# EAGLE schematic Led_Beleuchtung (EAGLE 7.3.0)

## Sheet 1 of 3
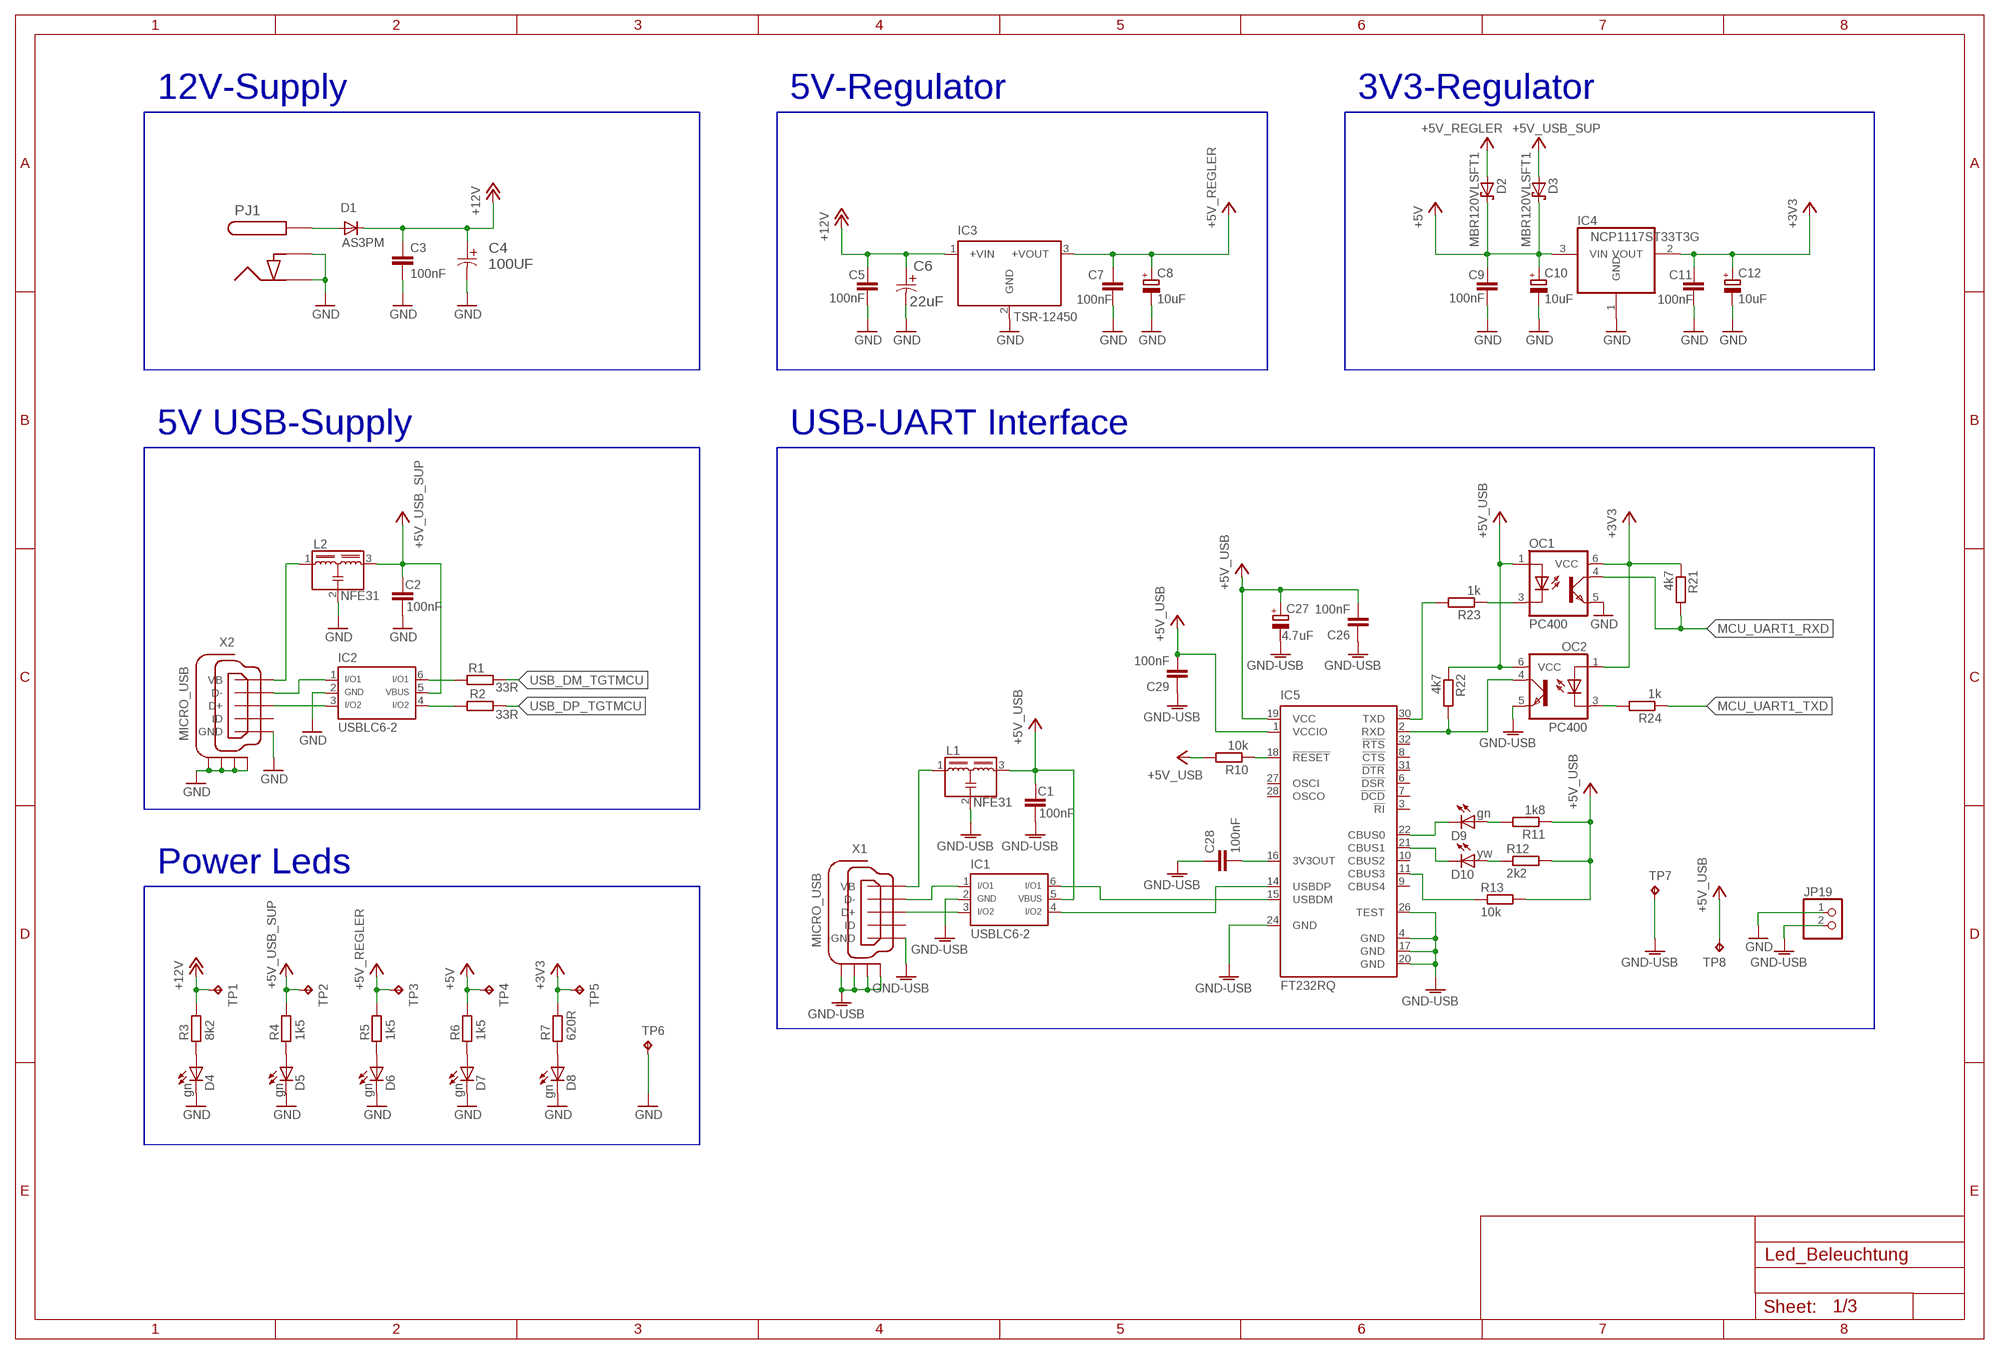
[diagram p0: schematic, sheet 1]

### Parts
C1  100nF  C-EUC0603K  [C0603K]
C2  100nF  C-EUC0603K  [C0603K]
C3  100nF  C-EUC0603K  [C0603K]
C4  100UF  EEE-FTH101XAP-CASE-D8  [CAPAE660X800N]
C5  100nF  C-EUC0603K  [C0603K]
C6  22uF  EEE--CASE-D  [CAPAE660X610N]
C7  100nF  C-EUC0603K  [C0603K]
C8  10uF  CPOL_EU0805  [SMC_P]
C9  100nF  C-EUC0603K  [C0603K]
C10  10uF  CPOL_EU0805  [SMC_P]
C11  100nF  C-EUC0603K  [C0603K]
C12  10uF  CPOL_EU0805  [SMC_P]
C26  100nF  C-EUC0603K  [C0603K]
C27  4.7uF  CPOL_EU0805  [SMC_P]
C28  100nF  C-EUC0603K  [C0603K]
C29  100nF  C-EUC0603  [C0603]
D1  AS3PM  [TO-277A]
D2  MBR120VLSFT1  [SOD-123]
D3  MBR120VLSFT1  [SOD-123]
D4  gn  LEDCHIP-LED0603  [CHIP-LED0603]
D5  gn  LEDCHIP-LED0603  [CHIP-LED0603]
D6  gn  LEDCHIP-LED0603  [CHIP-LED0603]
D7  gn  LEDCHIP-LED0603  [CHIP-LED0603]
D8  gn  LEDCHIP-LED0603  [CHIP-LED0603]
D9  gn  LEDCHIP-LED0603  [CHIP-LED0603]
D10  yw  LEDCHIP-LED0603  [CHIP-LED0603]
IC1  USBLC6-2  [SOT-23-6L]
IC2  USBLC6-2  [SOT-23-6L]
IC3  TSR-12450  [TSR-1]
IC4  NCP1117ST33T3G  REG1117  [SOT223]
IC5  FT232RQ  [QFN32]
JP19  PINHD-1X2  [1X02]
L1  NFE31  EMIFIL  [EMIFILTER]
L2  NFE31  EMIFIL  [EMIFILTER]
OC1  PC400  [PC400]
OC2  PC400  [PC400]
PJ1  PJ-002AH-SMT-TR  [PJ-002AH-SMT-TR]
R1  33R  R-EU_R0603  [R0603]
R2  33R  R-EU_R0603  [R0603]
R3  8k2  R-EU_R0603  [R0603]
R4  1k5  R-EU_R0603  [R0603]
R5  1k5  R-EU_R0603  [R0603]
R6  1k5  R-EU_R0603  [R0603]
R7  620R  R-EU_R0603  [R0603]
R10  10k  R-EU_R0603  [R0603]
R11  1k8  R-EU_R0603  [R0603]
R12  2k2  R-EU_R0603  [R0603]
R13  10k  R-EU_R0603  [R0603]
R21  4k7  R-EU_R0603  [R0603]
R22  4k7  R-EU_R0603  [R0603]
R23  1k  R-EU_R0603  [R0603]
R24  1k  R-EU_R0603  [R0603]
TP1  +12V  TPTP08R  [TP08R]
TP2  +5V_USB  TPTP08R  [TP08R]
TP3  +5V_Reg  TPTP08R  [TP08R]
TP4  +5V  TPTP08R  [TP08R]
TP5  +3V3  TPTP08R  [TP08R]
TP6  GND  TPTP08R  [TP08R]
TP7  GND  TPTP08R  [TP08R]
TP8  +5V  TPTP08R  [TP08R]
X1  MICRO_USB  [MICRO-USB]
X2  MICRO_USB  [MICRO-USB]

### Nets
3V3OUT_FT232: C28.2 IC5.16(3V3OUT)
+3V3: C11.2 C12.+ IC4.2(VOUT) OC1.6(VCC) OC2.1(A) R7.2 R21.1 TP5.TP ; also sheet 2
+5V: C9.2 C10.+ D2.C D3.C IC4.3(VIN) R6.2 TP4.TP ; also sheet 2
+5V_REGLER: C7.2 C8.+ D2.A IC3.3(+VOUT) R5.2 TP3.TP
+5V_USB: C1.2 C26.2 C27.+ C29.2 IC1.5 IC5.1(VCCIO) IC5.19(VCC) L1.3 OC1.1(A) OC2.6(VCC) R10.2 R11.1 R12.2 R13.2 R22.1 TP8.TP
+5V_USB_SUP: C2.2 D3.A IC2.5 L2.3 R4.2 TP2.TP
+12V: C3.2 C4.1 C5.2 C6.1 D1.C IC3.1(+VIN) R3.2 TP1.TP ; also sheet 3
GND: C2.1 C3.1 C4.2 C5.1 C6.2 C7.1 C8.- C9.1 C10.- C11.1 C12.- D4.C D5.C D6.C D7.C D8.C IC2.2 IC3.2(GND) IC4.1(GND) JP19.1 L2.2 OC1.5(EMI) PJ1.2 PJ1.3 TP6.TP X2.5(GND) X2.GND1(S1) X2.GND2(S2) X2.GND3(S3) X2.GND4(S4) ; also sheet 2,3
GND-USB: C1.1 C26.1 C27.- C28.1 C29.1 IC1.2 IC5.4(GND) IC5.17(GND) IC5.20(GND) IC5.24(GND) IC5.26(TEST) JP19.2 L1.2 OC2.5(EMI) TP7.TP X1.5(GND) X1.GND1(S1) X1.GND2(S2) X1.GND3(S3) X1.GND4(S4)
MCU_UART1_RXD: OC1.4(COL) R21.2 ; also sheet 2
MCU_UART1_TXD: R24.1 ; also sheet 2
N$3: IC5.18(!RESET) R10.1
N$9: D9.C IC5.22(CBUS0)
N$13: L1.1 X1.1(VB)
N$14: IC1.1 X1.2(D-)
N$15: IC1.3 X1.3(D+)
N$16: D4.A R3.1
N$17: L2.1 X2.1(VB)
N$18: D5.A R4.1
N$19: D10.C IC5.21(CBUS1)
N$21: D10.A R12.1
N$22: D9.A R11.2
N$23: IC5.11(CBUS3) R13.1
N$26: IC2.1 X2.2(D-)
N$27: IC2.3 X2.3(D+)
N$48: IC2.4 R2.1
N$49: IC2.6 R1.1
N$61: D6.A R5.1
N$86: D1.A1(A) D1.A2(A) PJ1.1.1 PJ1.1.2
N$88: D7.A R6.1
N$90: D8.A R7.1
N$91: OC1.3(C) R23.1
N$93: OC2.3(C) R24.2
N$95: IC5.30(TXD) R23.2
N$97: IC5.2(RXD) OC2.4(COL) R22.2
USB_DM_FT232: IC1.6 IC5.15(USBDM)
USB_DM_TGTMCU: R1.2 ; also sheet 2
USB_DP_FT232: IC1.4 IC5.14(USBDP)
USB_DP_TGTMCU: R2.2 ; also sheet 2
Unconnected: IC5.3(!RI) IC5.6(!DSR) IC5.7(!DCD) IC5.8(!CTS) IC5.9(CBUS4) IC5.10(CBUS2) IC5.27(OSCI) IC5.28(OSCO) IC5.31(!DTR) IC5.32(!RTS) X1.4(ID) X2.4(ID)

### Notes on the sheet
- 12V-Supply | 5V-Regulator | 3V3-Regulator
- 5V USB-Supply | USB-UART Interface
- Power Leds
- http://www.molex.com/pdm_docs/sd/5031821853_sd.pdf 
  http://pinouts.ru/Memory/sdcard_pinout.shtml 
  http://www.interfacebus.com/Secure_Digital_Card_Pinout.html 
  https://en.wikipedia.org/wiki/Secure_Digital

## Sheet 2 of 3
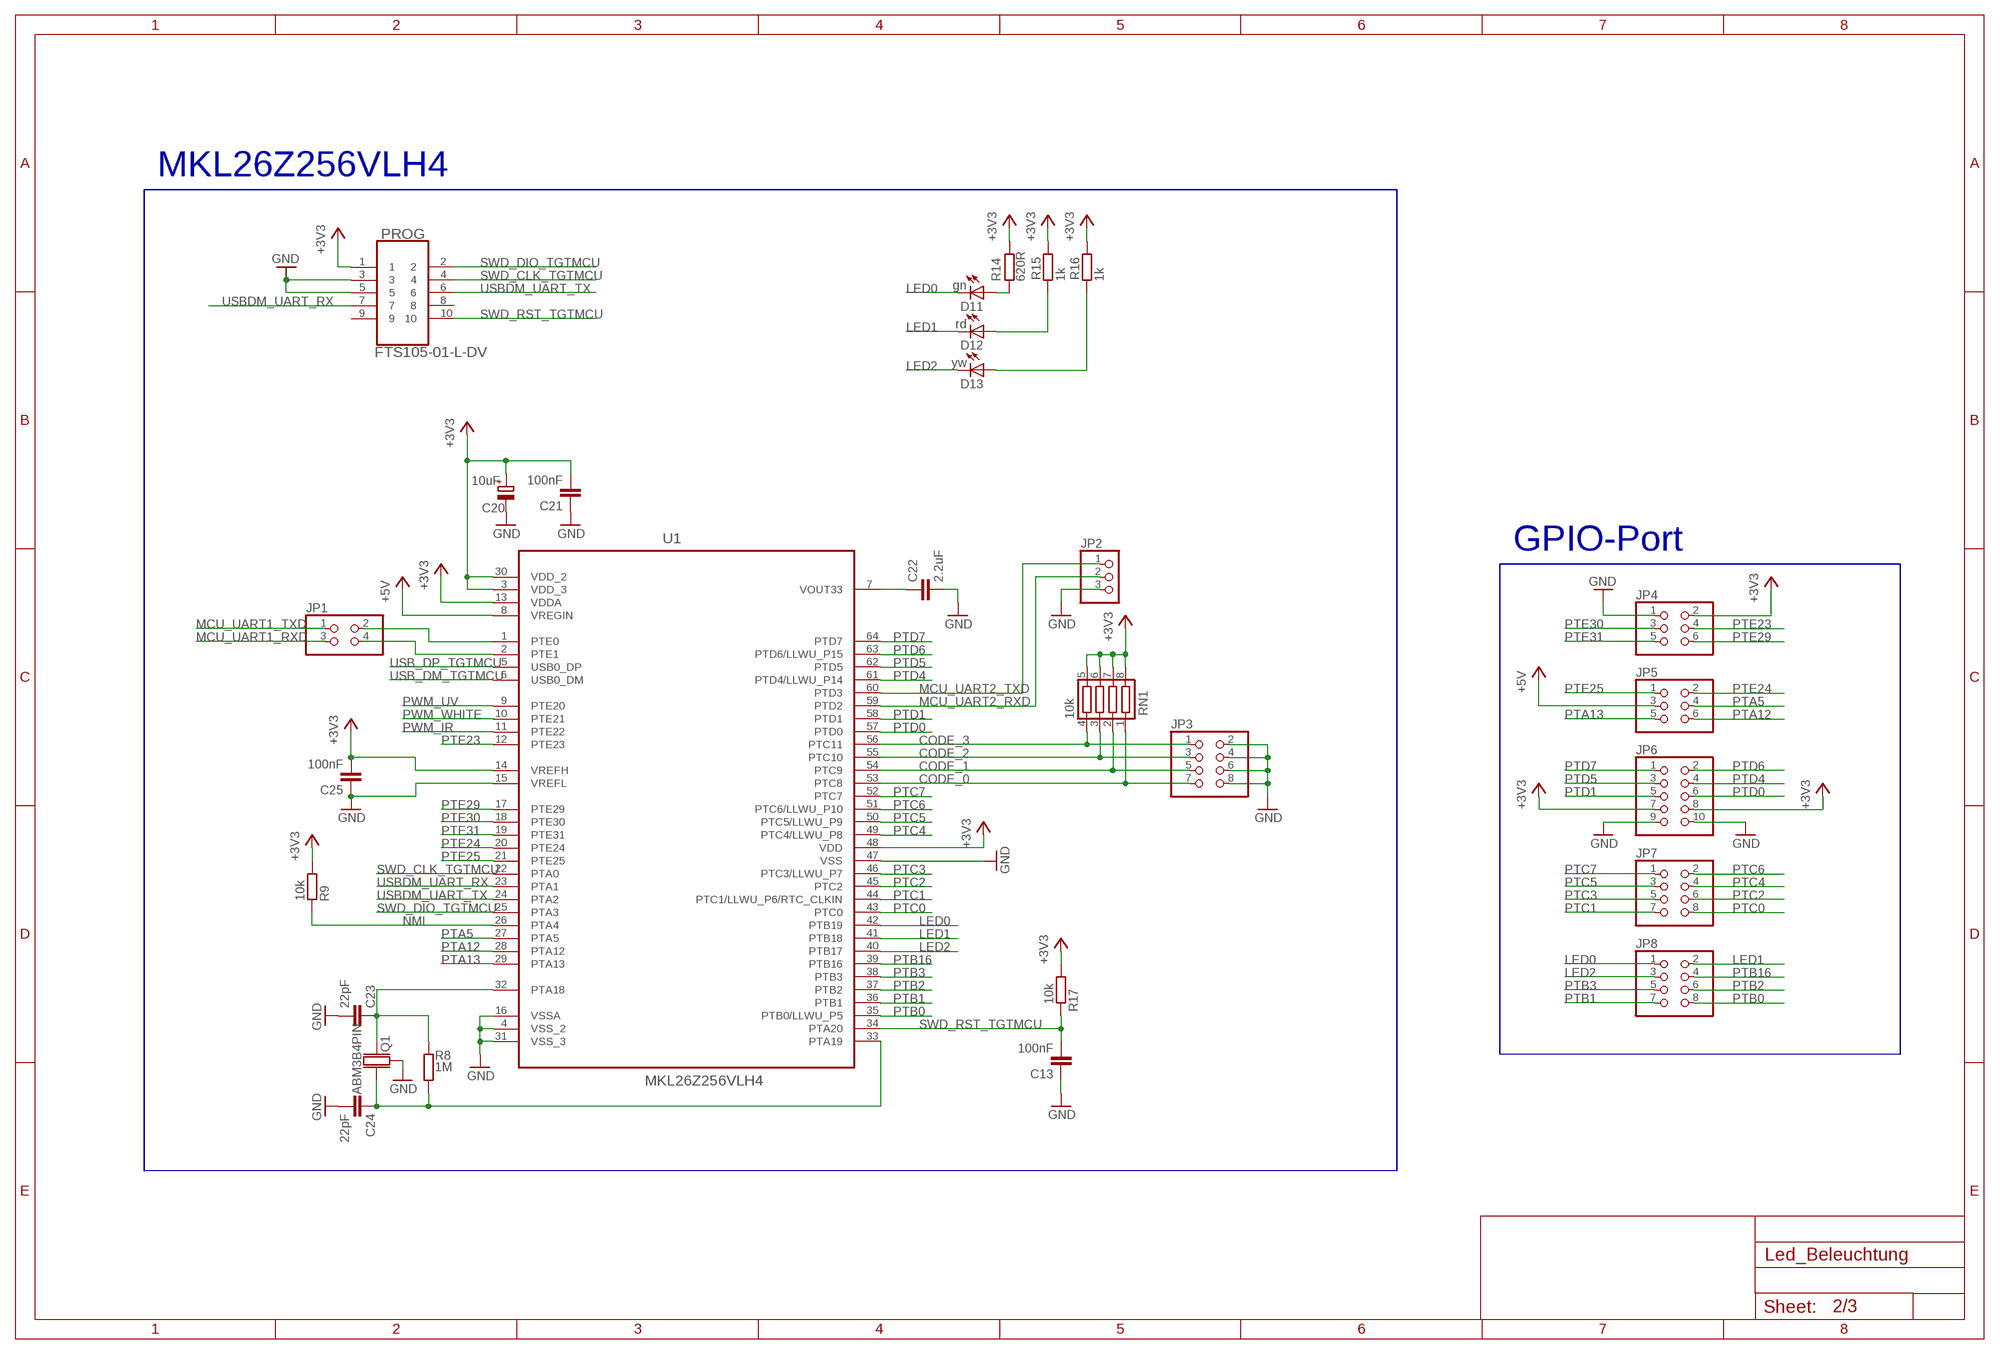
[diagram p1: schematic, sheet 2]

### Parts
C13  100nF  C-EUC0603  [C0603]
C20  10uF  CPOL_EU0805  [SMC_P]
C21  100nF  C-EUC0603  [C0603]
C22  2.2uF  C-EUC0603  [C0603]
C23  22pF  C-EUC0603  [C0603]
C24  22pF  C-EUC0603  [C0603]
C25  100nF  C-EUC0603K  [C0603K]
D11  gn  LEDCHIP-LED0603  [CHIP-LED0603]
D12  rd  LEDCHIP-LED0603  [CHIP-LED0603]
D13  yw  LEDCHIP-LED0603  [CHIP-LED0603]
JP1  PINHD-2X2  [2X02]
JP2  BCH-381H-3GN  [BCH-381H-3GN]
JP3  PINHD-2X4  [2X04]
JP4  PINHD-2X3  [2X03]
JP5  PINHD-2X3  [2X03]
JP6  PINHD-2X5  [2X05]
JP7  PINHD-2X4  [2X04]
JP8  PINHD-2X4  [2X04]
PROG  FTS105-01-L-DV  [SAMTEC_FTS105-01-L-DV]
Q1  ABM3B4PIN  [ABM3B]
R8  1M  R-EU_R0603  [R0603]
R9  10k  R-EU_R0603  [R0603]
R14  620R  R-EU_R0603  [R0603]
R15  1k  R-EU_R0603  [R0603]
R16  1k  R-EU_R0603  [R0603]
R17  10k  R-EU_R0603  [R0603]
RN1  10k  CTS742C083  [CTS742C083]
U1  MKL26Z256VLH4  [QFP50P1200X1200X160-64N]

### Nets
+3V3: C20.+ C21.2 C25.2 JP4.2 JP6.7 JP6.8 PROG.1 R9.1 R14.2 R15.2 R16.2 R17.1 RN1.5 RN1.6 RN1.7 RN1.8 U1.3(VDD_3) U1.13(VDDA) U1.14(VREFH) U1.30(VDD_2) U1.48(VDD) ; also sheet 1
+5V: JP5.3 U1.8(VREGIN) ; also sheet 1
CODE_0: JP3.7 RN1.1 U1.53(PTC8)
CODE_1: JP3.5 RN1.2 U1.54(PTC9)
CODE_2: JP3.3 RN1.3 U1.55(PTC10)
CODE_3: JP3.1 RN1.4 U1.56(PTC11)
GND: C13.1 C20.- C21.1 C22.2 C23.2 C24.2 C25.1 JP2.3 JP3.2 JP3.4 JP3.6 JP3.8 JP4.1 JP6.9 JP6.10 PROG.3 PROG.5 Q1.GND1(GND) Q1.GND2(GND) U1.4(VSS_2) U1.15(VREFL) U1.16(VSSA) U1.31(VSS_3) U1.47(VSS) ; also sheet 1,3
LED0: D11.C JP8.1 U1.42(PTB19)
LED1: D12.C JP8.2 U1.41(PTB18)
LED2: D13.C JP8.3 U1.40(PTB17)
MCU_UART1_RXD: JP1.3 ; also sheet 1
MCU_UART1_TXD: JP1.1 ; also sheet 1
MCU_UART2_RXD: JP2.2 U1.59(PTD2)
MCU_UART2_TXD: JP2.1 U1.60(PTD3)
N$10: C23.1 Q1.1 R8.2 U1.32(PTA18)
N$11: C24.1 Q1.3 R8.1 U1.33(PTA19)
N$12: D11.A R14.1
N$36: D12.A R15.1
N$37: D13.A R16.1
N$47: C22.1 U1.7(VOUT33)
N$92: JP1.2 U1.1(PTE0)
N$94: JP1.4 U1.2(PTE1)
NMI: R9.2 U1.26(PTA4)
PTA5: JP5.4 U1.27(PTA5)
PTA12: JP5.6 U1.28(PTA12)
PTA13: JP5.5 U1.29(PTA13)
PTB0: JP8.8 U1.35(PTB0/LLWU_P5)
PTB1: JP8.7 U1.36(PTB1)
PTB2: JP8.6 U1.37(PTB2)
PTB3: JP8.5 U1.38(PTB3)
PTB16: JP8.4 U1.39(PTB16)
PTC0: JP7.8 U1.43(PTC0)
PTC1: JP7.7 U1.44(PTC1/LLWU_P6/RTC_CLKIN)
PTC2: JP7.6 U1.45(PTC2)
PTC3: JP7.5 U1.46(PTC3/LLWU_P7)
PTC4: JP7.4 U1.49(PTC4/LLWU_P8)
PTC5: JP7.3 U1.50(PTC5/LLWU_P9)
PTC6: JP7.2 U1.51(PTC6/LLWU_P10)
PTC7: JP7.1 U1.52(PTC7)
PTD0: JP6.6 U1.57(PTD0)
PTD1: JP6.5 U1.58(PTD1)
PTD4: JP6.4 U1.61(PTD4/LLWU_P14)
PTD5: JP6.3 U1.62(PTD5)
PTD6: JP6.2 U1.63(PTD6/LLWU_P15)
PTD7: JP6.1 U1.64(PTD7)
PTE23: JP4.4 U1.12(PTE23)
PTE24: JP5.2 U1.20(PTE24)
PTE25: JP5.1 U1.21(PTE25)
PTE29: JP4.6 U1.17(PTE29)
PTE30: JP4.3 U1.18(PTE30)
PTE31: JP4.5 U1.19(PTE31)
PWM_IR: U1.11(PTE22) ; also sheet 3
PWM_UV: U1.9(PTE20) ; also sheet 3
PWM_WHITE: U1.10(PTE21) ; also sheet 3
SWD_CLK_TGTMCU: PROG.4 U1.22(PTA0)
SWD_DIO_TGTMCU: PROG.2 U1.25(PTA3)
SWD_RST_TGTMCU: C13.2 PROG.10 R17.2 U1.34(PTA20)
USB_DM_TGTMCU: U1.6(USB0_DM) ; also sheet 1
USB_DP_TGTMCU: U1.5(USB0_DP) ; also sheet 1
USBDM_UART_RX: PROG.7 U1.23(PTA1)
USBDM_UART_TX: PROG.6 U1.24(PTA2)
Unconnected: PROG.8 PROG.9

### Notes on the sheet
- MKL26Z256VLH4
- GPIO-Port

## Sheet 3 of 3
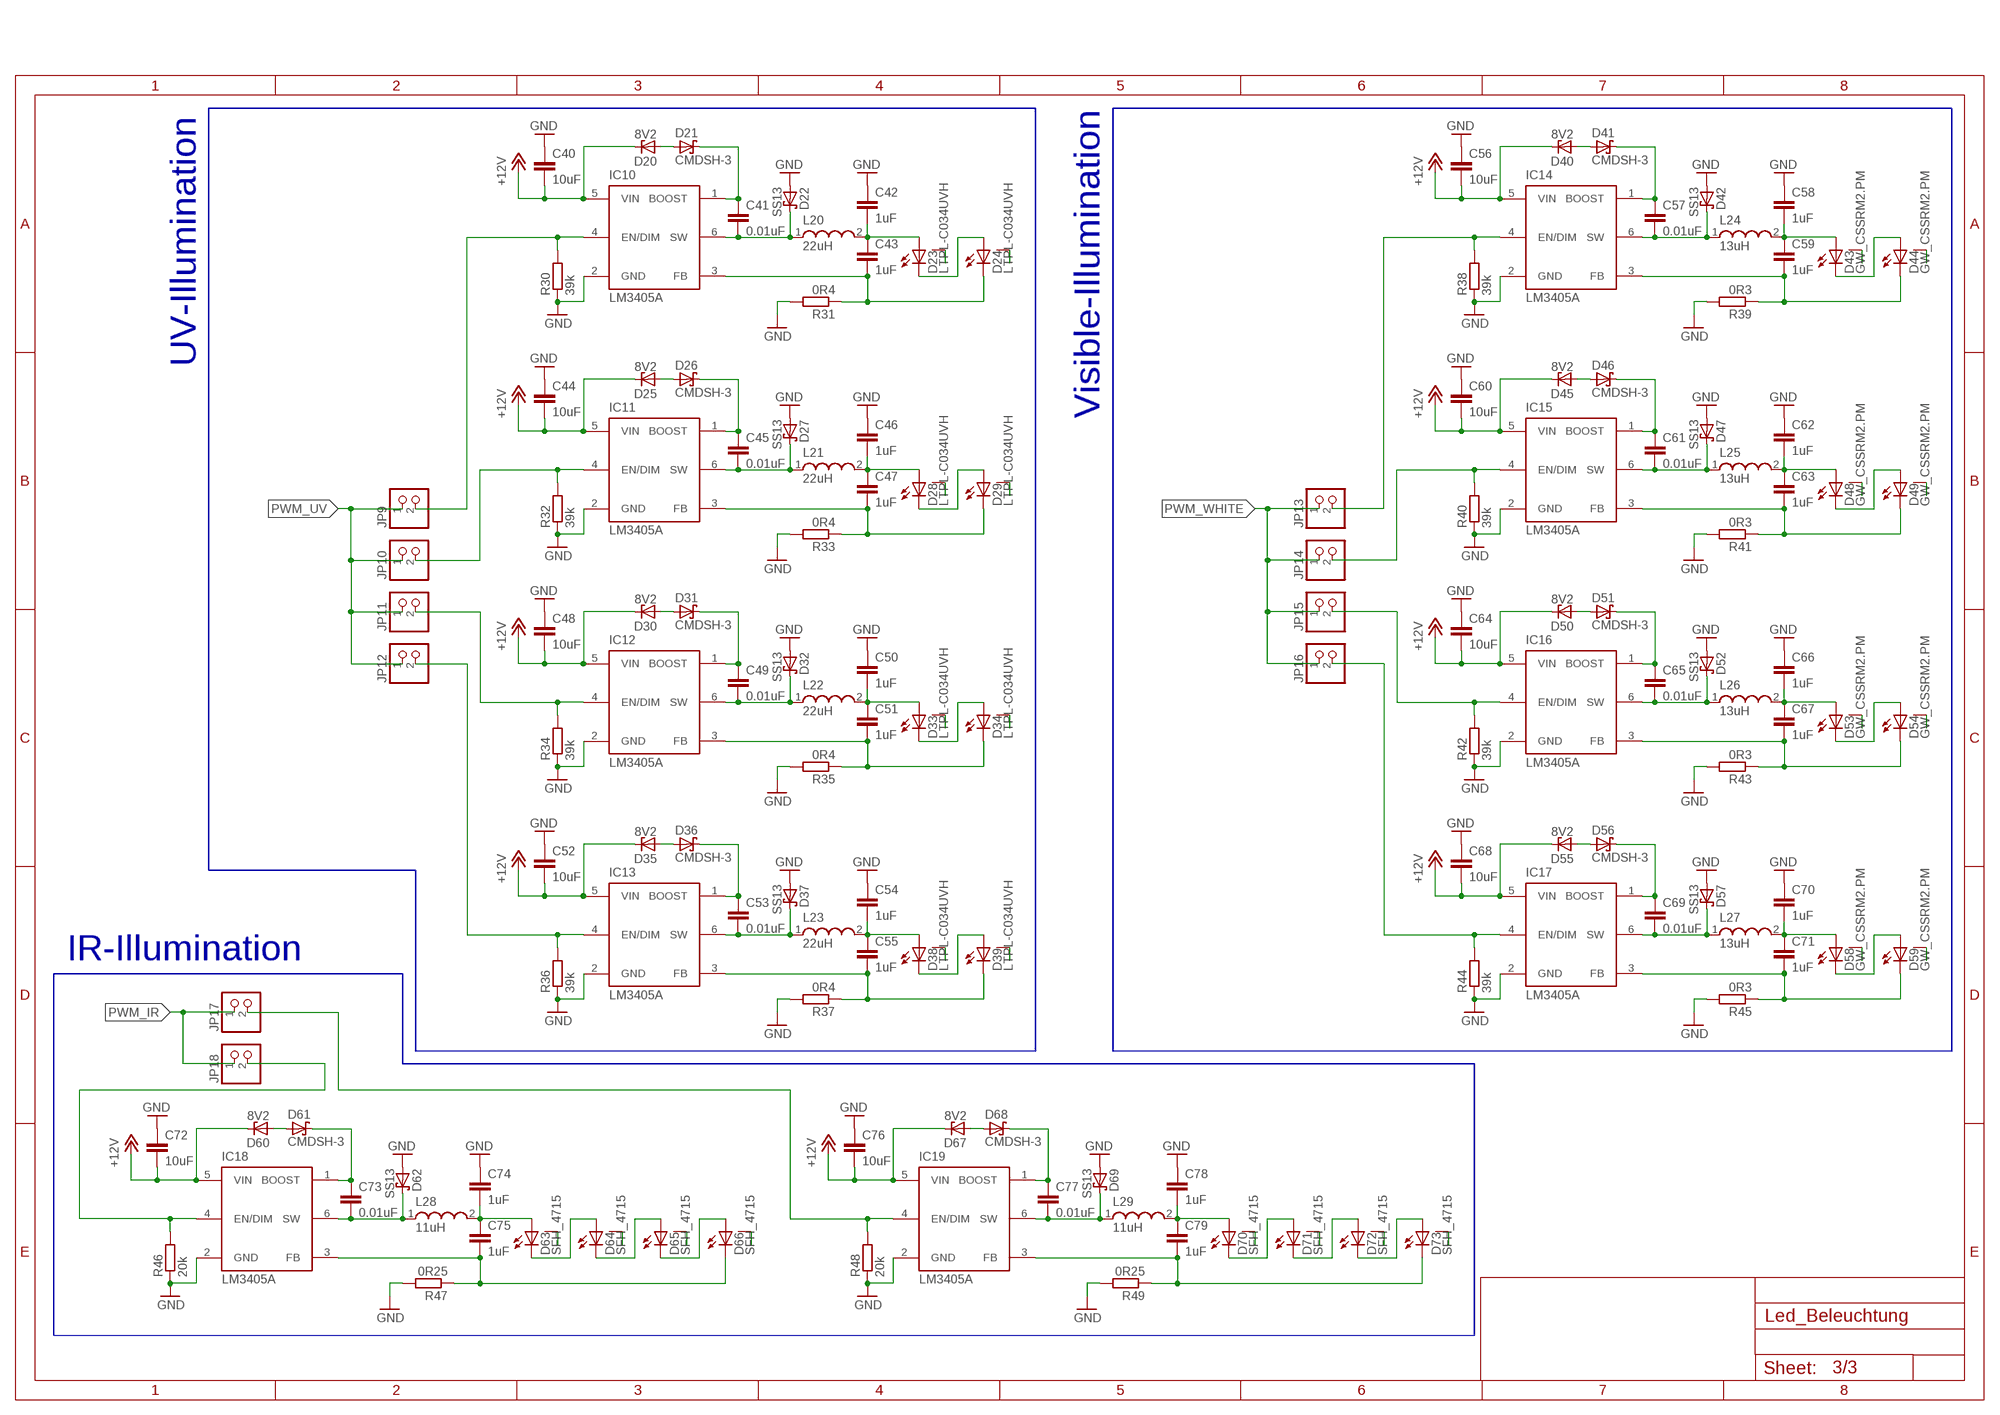
[diagram p2: schematic, sheet 3]

### Parts
C40  10uF  C-EUC1206K  [C1206K]
C41  0.01uF  C-EUC0805K  [C0805K]
C42  1uF  C-EUC1206K  [C1206K]
C43  1uF  C-EUC1206K  [C1206K]
C44  10uF  C-EUC1206K  [C1206K]
C45  0.01uF  C-EUC0805K  [C0805K]
C46  1uF  C-EUC1206K  [C1206K]
C47  1uF  C-EUC1206K  [C1206K]
C48  10uF  C-EUC1206K  [C1206K]
C49  0.01uF  C-EUC0805K  [C0805K]
C50  1uF  C-EUC1206K  [C1206K]
C51  1uF  C-EUC1206K  [C1206K]
C52  10uF  C-EUC1206K  [C1206K]
C53  0.01uF  C-EUC0805K  [C0805K]
C54  1uF  C-EUC1206K  [C1206K]
C55  1uF  C-EUC1206K  [C1206K]
C56  10uF  C-EUC1206K  [C1206K]
C57  0.01uF  C-EUC0805K  [C0805K]
C58  1uF  C-EUC1206K  [C1206K]
C59  1uF  C-EUC1206K  [C1206K]
C60  10uF  C-EUC1206K  [C1206K]
C61  0.01uF  C-EUC0805K  [C0805K]
C62  1uF  C-EUC1206K  [C1206K]
C63  1uF  C-EUC1206K  [C1206K]
C64  10uF  C-EUC1206K  [C1206K]
C65  0.01uF  C-EUC0805K  [C0805K]
C66  1uF  C-EUC1206K  [C1206K]
C67  1uF  C-EUC1206K  [C1206K]
C68  10uF  C-EUC1206K  [C1206K]
C69  0.01uF  C-EUC0805K  [C0805K]
C70  1uF  C-EUC1206K  [C1206K]
C71  1uF  C-EUC1206K  [C1206K]
C72  10uF  C-EUC1206K  [C1206K]
C73  0.01uF  C-EUC0805K  [C0805K]
C74  1uF  C-EUC1206K  [C1206K]
C75  1uF  C-EUC1206K  [C1206K]
C76  10uF  C-EUC1206K  [C1206K]
C77  0.01uF  C-EUC0805K  [C0805K]
C78  1uF  C-EUC1206K  [C1206K]
C79  1uF  C-EUC1206K  [C1206K]
D20  8V2  ZENER-DIODESOT23  [SOT23]
D21  CMDSH-3  [SOD323]
D22  SS13  [DO-214AC]
D23  LTPL-C034UVH  [LTPL-C034UVH]
D24  LTPL-C034UVH  [LTPL-C034UVH]
D25  8V2  ZENER-DIODESOT23  [SOT23]
D26  CMDSH-3  [SOD323]
D27  SS13  [DO-214AC]
D28  LTPL-C034UVH  [LTPL-C034UVH]
D29  LTPL-C034UVH  [LTPL-C034UVH]
D30  8V2  ZENER-DIODESOT23  [SOT23]
D31  CMDSH-3  [SOD323]
D32  SS13  [DO-214AC]
D33  LTPL-C034UVH  [LTPL-C034UVH]
D34  LTPL-C034UVH  [LTPL-C034UVH]
D35  8V2  ZENER-DIODESOT23  [SOT23]
D36  CMDSH-3  [SOD323]
D37  SS13  [DO-214AC]
D38  LTPL-C034UVH  [LTPL-C034UVH]
D39  LTPL-C034UVH  [LTPL-C034UVH]
D40  8V2  ZENER-DIODESOT23  [SOT23]
D41  CMDSH-3  [SOD323]
D42  SS13  [DO-214AC]
D43  GW_CSSRM2.PM  [GW_CSSRM2.PM]
D44  GW_CSSRM2.PM  [GW_CSSRM2.PM]
D45  8V2  ZENER-DIODESOT23  [SOT23]
D46  CMDSH-3  [SOD323]
D47  SS13  [DO-214AC]
D48  GW_CSSRM2.PM  [GW_CSSRM2.PM]
D49  GW_CSSRM2.PM  [GW_CSSRM2.PM]
D50  8V2  ZENER-DIODESOT23  [SOT23]
D51  CMDSH-3  [SOD323]
D52  SS13  [DO-214AC]
D53  GW_CSSRM2.PM  [GW_CSSRM2.PM]
D54  GW_CSSRM2.PM  [GW_CSSRM2.PM]
D55  8V2  ZENER-DIODESOT23  [SOT23]
D56  CMDSH-3  [SOD323]
D57  SS13  [DO-214AC]
D58  GW_CSSRM2.PM  [GW_CSSRM2.PM]
D59  GW_CSSRM2.PM  [GW_CSSRM2.PM]
D60  8V2  ZENER-DIODESOT23  [SOT23]
D61  CMDSH-3  [SOD323]
D62  SS13  [DO-214AC]
D63  SFH_4715  [SFH_4715]
D64  SFH_4715  [SFH_4715]
D65  SFH_4715  [SFH_4715]
D66  SFH_4715  [SFH_4715]
D67  8V2  ZENER-DIODESOT23  [SOT23]
D68  CMDSH-3  [SOD323]
D69  SS13  [DO-214AC]
D70  SFH_4715  [SFH_4715]
D71  SFH_4715  [SFH_4715]
D72  SFH_4715  [SFH_4715]
D73  SFH_4715  [SFH_4715]
IC10  LM3405A  [DDC6_SOT]
IC11  LM3405A  [DDC6_SOT]
IC12  LM3405A  [DDC6_SOT]
IC13  LM3405A  [DDC6_SOT]
IC14  LM3405A  [DDC6_SOT]
IC15  LM3405A  [DDC6_SOT]
IC16  LM3405A  [DDC6_SOT]
IC17  LM3405A  [DDC6_SOT]
IC18  LM3405A  [DDC6_SOT]
IC19  LM3405A  [DDC6_SOT]
JP9  PINHD-1X2  [1X02]
JP10  PINHD-1X2  [1X02]
JP11  PINHD-1X2  [1X02]
JP12  PINHD-1X2  [1X02]
JP13  PINHD-1X2  [1X02]
JP14  PINHD-1X2  [1X02]
JP15  PINHD-1X2  [1X02]
JP16  PINHD-1X2  [1X02]
JP17  PINHD-1X2  [1X02]
JP18  PINHD-1X2  [1X02]
L20  22uH  WE-PDF_1064  [WE-PDF]
L21  22uH  WE-PDF_1064  [WE-PDF]
L22  22uH  WE-PDF_1064  [WE-PDF]
L23  22uH  WE-PDF_1064  [WE-PDF]
L24  13uH  WE-PDF_1064  [WE-PDF]
L25  13uH  WE-PDF_1064  [WE-PDF]
L26  13uH  WE-PDF_1064  [WE-PDF]
L27  13uH  WE-PDF_1064  [WE-PDF]
L28  11uH  WE-PDF_1064  [WE-PDF]
L29  11uH  WE-PDF_1064  [WE-PDF]
R30  39k  R-EU_R0603  [R0603]
R31  0R4  R-EU_R2010  [R2010]
R32  39k  R-EU_R0603  [R0603]
R33  0R4  R-EU_R2010  [R2010]
R34  39k  R-EU_R0603  [R0603]
R35  0R4  R-EU_R2010  [R2010]
R36  39k  R-EU_R0603  [R0603]
R37  0R4  R-EU_R2010  [R2010]
R38  39k  R-EU_R0603  [R0603]
R39  0R3  R-EU_R2010  [R2010]
R40  39k  R-EU_R0603  [R0603]
R41  0R3  R-EU_R2010  [R2010]
R42  39k  R-EU_R0603  [R0603]
R43  0R3  R-EU_R2010  [R2010]
R44  39k  R-EU_R0603  [R0603]
R45  0R3  R-EU_R2010  [R2010]
R46  20k  R-EU_R0603  [R0603]
R47  0R25  R-EU_R2010  [R2010]
R48  20k  R-EU_R0603  [R0603]
R49  0R25  R-EU_R2010  [R2010]

### Nets
+12V: C40.2 C44.2 C48.2 C52.2 C56.2 C60.2 C64.2 C68.2 C72.2 C76.2 D20.3(C) D25.3(C) D30.3(C) D35.3(C) D40.3(C) D45.3(C) D50.3(C) D55.3(C) D60.3(C) D67.3(C) IC10.5(VIN) IC11.5(VIN) IC12.5(VIN) IC13.5(VIN) IC14.5(VIN) IC15.5(VIN) IC16.5(VIN) IC17.5(VIN) IC18.5(VIN) IC19.5(VIN) ; also sheet 1
GND: C40.1 C42.1 C44.1 C46.1 C48.1 C50.1 C52.1 C54.1 C56.1 C58.1 C60.1 C62.1 C64.1 C66.1 C68.1 C70.1 C72.1 C74.1 C76.1 C78.1 D22.A D27.A D32.A D37.A D42.A D47.A D52.A D57.A D62.A D69.A IC10.2(GND) IC11.2(GND) IC12.2(GND) IC13.2(GND) IC14.2(GND) IC15.2(GND) IC16.2(GND) IC17.2(GND) IC18.2(GND) IC19.2(GND) R30.1 R31.2 R32.1 R33.2 R34.1 R35.2 R36.1 R37.2 R38.1 R39.2 R40.1 R41.2 R42.1 R43.2 R44.1 R45.2 R46.1 R47.2 R48.1 R49.2 ; also sheet 1,2
LED_WHITE8: D58.C D59.A
N$1: C77.1 D68.C IC19.1(BOOST)
N$2: D67.1(A) D68.A
N$4: C77.2 D69.C IC19.6(SW) L29.1
N$5: C78.2 C79.1 D70.A L29.2
N$6: D70.C D71.A
N$7: D71.C D72.A
N$8: D72.C D73.A
N$20: C79.2 D73.C IC19.3(FB) R49.1
N$24: C57.1 D41.C IC14.1(BOOST)
N$25: C73.1 D61.C IC18.1(BOOST)
N$28: D60.1(A) D61.A
N$29: C73.2 D62.C IC18.6(SW) L28.1
N$30: C74.2 C75.1 D63.A L28.2
N$31: D63.C D64.A
N$32: D64.C D65.A
N$33: D65.C D66.A
N$34: C75.2 D66.C IC18.3(FB) R47.1
N$35: D40.1(A) D41.A
N$38: C57.2 D42.C IC14.6(SW) L24.1
N$39: C58.2 C59.1 D43.A L24.2
N$40: D43.C D44.A
N$41: C61.1 D46.C IC15.1(BOOST)
N$42: D45.1(A) D46.A
N$43: C59.2 D44.C IC14.3(FB) R39.1
N$44: C61.2 D47.C IC15.6(SW) L25.1
N$45: C62.2 C63.1 D48.A L25.2
N$46: D48.C D49.A
N$50: C63.2 D49.C IC15.3(FB) R41.1
N$51: C65.1 D51.C IC16.1(BOOST)
N$52: D50.1(A) D51.A
N$53: C65.2 D52.C IC16.6(SW) L26.1
N$54: C66.2 C67.1 D53.A L26.2
N$55: D53.C D54.A
N$56: C67.2 D54.C IC16.3(FB) R43.1
N$57: C69.1 D56.C IC17.1(BOOST)
N$58: D55.1(A) D56.A
N$59: C69.2 D57.C IC17.6(SW) L27.1
N$60: C70.2 C71.1 D58.A L27.2
N$62: C71.2 D59.C IC17.3(FB) R45.1
N$63: C41.1 D21.C IC10.1(BOOST)
N$64: D20.1(A) D21.A
N$65: C41.2 D22.C IC10.6(SW) L20.1
N$66: C42.2 C43.1 D23.A L20.2
N$67: D23.C D24.A
N$68: C43.2 D24.C IC10.3(FB) R31.1
N$69: C45.1 D26.C IC11.1(BOOST)
N$70: D25.1(A) D26.A
N$71: C45.2 D27.C IC11.6(SW) L21.1
N$72: C46.2 C47.1 D28.A L21.2
N$73: D28.C D29.A
N$74: C47.2 D29.C IC11.3(FB) R33.1
N$75: C49.1 D31.C IC12.1(BOOST)
N$76: D30.1(A) D31.A
N$77: C49.2 D32.C IC12.6(SW) L22.1
N$78: C50.2 C51.1 D33.A L22.2
N$79: D33.C D34.A
N$80: C51.2 D34.C IC12.3(FB) R35.1
N$81: C53.1 D36.C IC13.1(BOOST)
N$82: D35.1(A) D36.A
N$83: C53.2 D37.C IC13.6(SW) L23.1
N$84: C54.2 C55.1 D38.A L23.2
N$85: D38.C D39.A
N$87: C55.2 D39.C IC13.3(FB) R37.1
N$98: IC10.4(EN/DIM) JP9.2 R30.2
N$99: IC11.4(EN/DIM) JP10.2 R32.2
N$100: IC12.4(EN/DIM) JP11.2 R34.2
N$101: IC13.4(EN/DIM) JP12.2 R36.2
N$102: IC14.4(EN/DIM) JP13.2 R38.2
N$103: IC15.4(EN/DIM) JP14.2 R40.2
N$104: IC16.4(EN/DIM) JP15.2 R42.2
N$105: IC17.4(EN/DIM) JP16.2 R44.2
N$106: IC18.4(EN/DIM) JP18.2 R46.2
N$107: IC19.4(EN/DIM) JP17.2 R48.2
PWM_IR: JP17.1 JP18.1 ; also sheet 2
PWM_UV: JP9.1 JP10.1 JP11.1 JP12.1 ; also sheet 2
PWM_WHITE: JP13.1 JP14.1 JP15.1 JP16.1 ; also sheet 2
TH_D23: D23.TH
TH_D24: D24.TH
TH_D28: D28.TH
TH_D29: D29.TH
TH_D33: D33.TH
TH_D34: D34.TH
TH_D38: D38.TH
TH_D39: D39.TH
TH_D43: D43.TH
TH_D44: D44.TH
TH_D48: D48.TH
TH_D49: D49.TH
TH_D53: D53.TH
TH_D54: D54.TH
TH_D58: D58.TH
TH_D59: D59.TH
TH_D63: D63.TH
TH_D64: D64.TH
TH_D65: D65.TH
TH_D66: D66.TH
TH_D70: D70.TH
TH_D71: D71.TH
TH_D72: D72.TH
TH_D73: D73.TH

### Notes on the sheet
- UV-Illumination
- Visible-Illumination
- IR-Illumination

## Library data of the parts
C1-C3 C5 C7 C9 C11 C13 C21-C26 C28 C29 C40-C79 = rcl:C-EU: CAPACITOR, European symbol
C4 = Panasonic-EEEFT_EEEH:EEE-: Aluminum Electrolytic Capacitors,Surface Mount Type; MPN: EEE-FTH101XAP; OC_FARNELL: 1868426; OC_NEWARK: 31T8172; PACKAGE: CASE-D8; SUPPLIER: PANASONIC; TOLERANCE: ±20 %; VOLTAGERATING: 50V
C6 = Panasonic-EEEFT_EEEH:EEE-: Aluminum Electrolytic Capacitors,Surface Mount Type
C8 C10 C12 C20 C27 = myLib:CPOL_EU: Solid Tantalum SMD Cap, Size 0805 or P Footprint from: http://www.niccomp.com/Products/smt/NTCMRK1000.pdf Tantalum Farnell: http://www.farnell.com/datasheets/1948248.pdf Farnell Nr. : 2491435RL Solid Tantalum SMD Cap, Size 1411 or B Tantalum Farnell: http://www.farnell.com/datasheets/2245107.pdf?_ga=1.151905337.1400796248.1488872329f Farnell Nr. : TMCUB1C106KTRF
D1 = myLib:AS3PM: http://www.mouser.com/ds/2/427/as3pd-101473.pdf
D2 D3 = myLib:MBR120VLSFT1: Schottky Power Rectifier Source: http://www.mouser.com/ds/2/308/MBR120VLSFT1-D-107081.pdf
D4-D13 = led:LED: LED OSRAM: - CHIPLED LG R971, LG N971, LY N971, LG Q971, LY Q971, LO R971, LY R971 LH N974, LH R974 LS Q976, LO Q976, LY Q976 LO Q996 - Hyper CHIPLED LW Q18S LB Q993, LB Q99A, LB R99A - SideLED LS A670, LO A670, LY A670, LG A670, LP A670 LB A673, LV A673, LT A673, LW A673 LH A674 LY A675 LS A676, LA A676, LO A676, LY A676, LW A676 LS A679, LY A679, LG A679 - Hyper Micro SIDELED® LS Y876, LA Y876, LO Y876, LY Y876 LT Y87S - SmartLED LW L88C, LW L88S LB L89C, LB L89S, LG L890 LS L89K, LO L89K, LY L89K LS L896, LA L896, LO L896, LY L896 - TOPLED LS T670, LO T670, LY T670, LG T670, LP T670 LSG T670, LSP T670, LSY T670, LOP T670, LYG T670 LG T671, LOG T671, LSG T671 LB T673, LV T673, LT T673, LW T673 LH T674 LS T676, LA T676, LO T676, LY T676, LB T676, LH T676, LSB T676, LW T676 LB T67C, LV T67C, LT T67C, LS T67K, LO T67K, LY T67K, LW E67C LS E67B, LA E67B, LO E67B, LY E67B, LB E67C, LV E67C, LT E67C LW T67C LS T679, LY T679, LG T679 LS T770, LO T770, LY T770, LG T770, LP T770 LB T773, LV T773, LT T773, LW T773 LH T774 LS E675, LA E675, LY E675, LS T675 LS T776, LA T776, LO T776, LY T776, LB T776 LHGB T686 LT T68C, LB T68C - Hyper Mini TOPLED® LB M676 - Mini TOPLED Santana® LG M470 LS M47K, LO M47K, LY M47K Source: http://www.osram.convergy.de LUXEON: - LUMILED® LXK2-PW12-R00, LXK2-PW12-S00, LXK2-PW14-U00, LXK2-PW14-V00 LXK2-PM12-R00, LXK2-PM12-S00, LXK2-PM14-U00 LXK2-PE12-Q00, LXK2-PE12-R00, LXK2-PE12-S00, LXK2-PE14-T00, LXK2-PE14-U00 LXK2-PB12-K00, LXK2-PB12-L00, LXK2-PB12-M00, LXK2-PB14-N00, LXK2-PB14-P00, LXK2-PB14-Q00 LXK2-PR12-L00, LXK2-PR12-M00, LXK2-PR14-Q00, LXK2-PR14-R00 LXK2-PD12-Q00, LXK2-PD12-R00, LXK2-PD12-S00 LXK2-PH12-R00, LXK2-PH12-S00 LXK2-PL12-P00, LXK2-PL12-Q00, LXK2-PL12-R00 Source: www.luxeon.com KINGBRIGHT: KA-3528ASYC Source: www.kingbright.com
D20 D25 D30 D35 D40 D45 D50 D55 D60 D67 = diode:ZENER-DIODE: Z-Diode
D21 D26 D31 D36 D41 D46 D51 D56 D61 D68 = myLib:CMDSH-3: http://www.mouser.com/ds/2/68/cmdsh-3-39175.pdf
D22 D27 D32 D37 D42 D47 D52 D57 D62 D69 = myLib:SS13: http://www.mouser.com/ds/2/427/ss12-100300.pdf
D23 D24 D28 D29 D33 D34 D38 D39 = myLib:LTPL-C034UVH: LITEON Led High Power LTPL-C034UVH385 Source: http://www.mouser.com/ds/2/239/LTPL-C034UVH385%20DataSheet_Ver4_20150916-775666.pdf
D43 D44 D48 D49 D53 D54 D58 D59 = myLib:GW_CSSRM2.PM: OSLON ® Square: GW CSSRM2.PM Source: http://www.mouser.com/ds/2/311/GW%20CSSRM2.PM%20-%20OSLON%20Square%20Gen%203%20(EnglishDeutsch)-1073956.pdf
D63-D66 D70-D73 = myLib:SFH_4715: OSLON Black Series (850 nm) - 90° SFH 4715 Source: http://www.osram-os.com/Graphics/XPic7/00204173_0.pdf
IC1 IC2 = myLib:USBLC6-2: http://www.farnell.com/datasheets/1690354.pdf?_ga=1.240650499.1400796248.1488872329
IC3 = myLib:TSR-1: DC/DC Converter TSR-1 Series Source: http://www.farnell.com/datasheets/1763604.pdf?_ga=1.177088805.1400796248.1488872329
IC4 = burr-brown:REG1117: 800mA and 1A Low Dropout (LDO) Positive Regulator 1.8V, 2.5V, 2.85V, 3.3V, 5V, and Adj; MPN: REG1117; OC_FARNELL: 1097566; OC_NEWARK: 14P6981
IC5 = ftdichip:FT232R: Source: http://www.ftdichip.com/Documents/DataSheets/DS_FT232R_v104.pdf; MPN: FT232RQ; OC_FARNELL: 1146033; OC_NEWARK: 91K9919
IC10-IC19 = myLib:LM3405A: 1-A Constant Current Buck LED Driver With Internal Compensation APPLICATIONS: LED Drivers Constant Current Sources Industrial Lighting LED Flashlights LED Lightbulbs Source: http://www.ti.com/lit/ds/symlink/lm3405a.pdf
JP1 = pinhead:PINHD-2X2: PIN HEADER
JP2 = myLib:BCH-381H-3GN: Printed-circuit board connectorR http://www.mouser.com/ds/2/324/ItemDetail_5444275-932016.pdf
JP3 JP7 JP8 = pinhead:PINHD-2X4: PIN HEADER
JP4 JP5 = pinhead:PINHD-2X3: PIN HEADER
JP6 = pinhead:PINHD-2X5: PIN HEADER
JP9-JP19 = pinhead:PINHD-1X2: PIN HEADER
L1 L2 = myLib:EMIFIL
L20-L29 = EAGLE-POWER_MAGNETICS-rev17a:WE-PDF: SMD Shielded Flatwire Power Inductor Characteristics Core material: NiZn Flat wire power inductor Advanced operating temperature: –40 °C up to +150 °C Magnetically shielded which results in a low leakage field Low self-losses High saturation current Flat wire coil for lower losses at high frequency ranges High Self Resonance Frequency Applications Suitable for high frequency switching regulators <http://katalog.we-online.de/media/images/v2/Family_WE-PDF%20Gruppe.jpg> Details see: http://katalog.we-online.de/en/pbs/WE-PDF? Updated by Dan Xu 2014-07-08 2014 (C) Wurth Elektronik
OC1 OC2 = myLib:PC400: 6-Pin Phototransistor Optocouplers Source: http://www.mouser.com/ds/2/365/pc400_e-184091.pdf
PJ1 = power_jack:PJ-002AH-SMT-TR
PROG = myLib:FTS105-01-L-DV
Q1 = myLib:ABM3B: Quarz 8 MHz: http://www.abracon.com/Resonators/abm3b.pdf
R1-R17 R21-R24 R30-R49 = rcl:R-EU_: RESISTOR, European symbol
RN1 = resistor-net:CTS742C083: Chip Resistor Array 4 Single Resistor Source: http://www.ctscorp.com/components/Datasheets/CTSChipArrayDs.pdf; OC_FARNELL: unknown; OC_NEWARK: unknown
TP1-TP8 = testpad:TP: Test pad
U1 = myLib:MKL26Z256VLH4: 16BIT MCU, CORTEX M0+, 48MHZ, 64QFP; MPN: MKL26Z256VLH4; OC_FARNELL: 2360680; OC_NEWARK: 09X0214; PACKAGE: LQFP-64; SUPPLIER: FREESCALE SEMICONDUCTOR
X1 X2 = myLib:MICRO_USB: http://www.farnell.com/datasheets/1469072.pdf?_ga=1.139799603.1400796248.1488872329